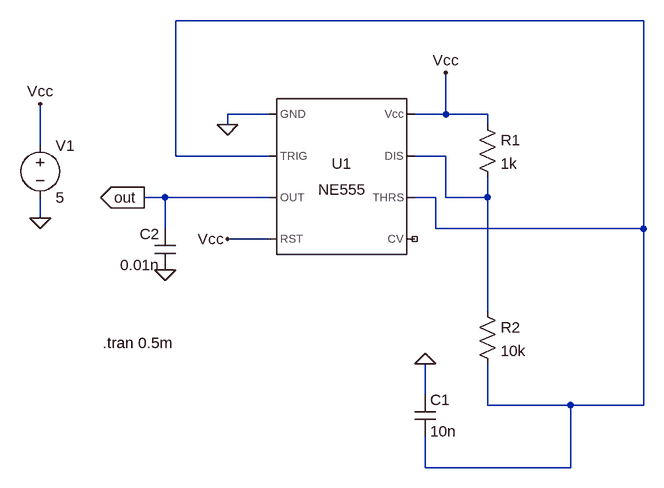
[diagram p0: schematic Draft33.asc]
Draft33.asc, the LTspice schematic file:
Version 4
SHEET 1 880 680
WIRE 640 -48 -80 -48
WIRE 64 96 0 96
WIRE 336 96 336 32
WIRE 336 96 288 96
WIRE 400 96 336 96
WIRE 0 112 0 96
WIRE 400 112 400 96
WIRE -288 144 -288 80
WIRE -80 160 -80 -48
WIRE 64 160 -80 160
WIRE 336 160 288 160
WIRE -96 224 -128 224
WIRE 64 224 -96 224
WIRE 320 224 288 224
WIRE 336 224 336 160
WIRE 400 224 400 192
WIRE 400 224 336 224
WIRE -288 256 -288 224
WIRE -96 272 -96 224
WIRE 320 272 320 224
WIRE 640 272 640 -48
WIRE 640 272 320 272
WIRE 64 288 0 288
WIRE 400 400 400 224
WIRE 304 528 304 480
WIRE 400 544 400 480
WIRE 528 544 400 544
WIRE 640 544 640 272
WIRE 640 544 528 544
WIRE 304 640 304 592
WIRE 528 640 528 544
WIRE 528 640 304 640
FLAG 0 112 0
FLAG 336 32 Vcc
FLAG 0 288 Vcc
FLAG 304 480 0
FLAG -288 80 Vcc
FLAG -288 256 0
FLAG -128 224 out
IOPIN -128 224 Out
FLAG -96 336 0
SYMBOL Misc\\NE555 176 192 R0
SYMATTR InstName U1
SYMBOL res 384 384 R0
SYMATTR InstName R2
SYMATTR Value 10k
SYMBOL res 384 96 R0
SYMATTR InstName R1
SYMATTR Value 1k
SYMBOL cap 288 528 R0
SYMATTR InstName C1
SYMATTR Value 10n
SYMBOL voltage -288 128 R0
WINDOW 123 0 0 Left 0
WINDOW 39 0 0 Left 0
SYMATTR InstName V1
SYMATTR Value 5
SYMBOL cap -80 336 R180
WINDOW 0 24 56 Left 2
WINDOW 3 24 8 Left 2
SYMATTR InstName C2
SYMATTR Value 0.01n
TEXT -192 448 Left 2 !.tran 0.5m

The netlist it stands for:
* Draft33.asc
XU1 0 N001 out Vcc NC_01 N001 N002 Vcc NE555  ; pins GND TRIG OUT RST CV THRS DIS Vcc
R2 N002 N001 10k
R1 Vcc N002 1k
C1 0 N001 10n
V1 Vcc 0 5
C2 0 out 0.01n
.tran 0.5m
.lib NE555.sub
.backanno
.end